# Altium schematic sheet HBridge_and_Power.SchDoc
size A
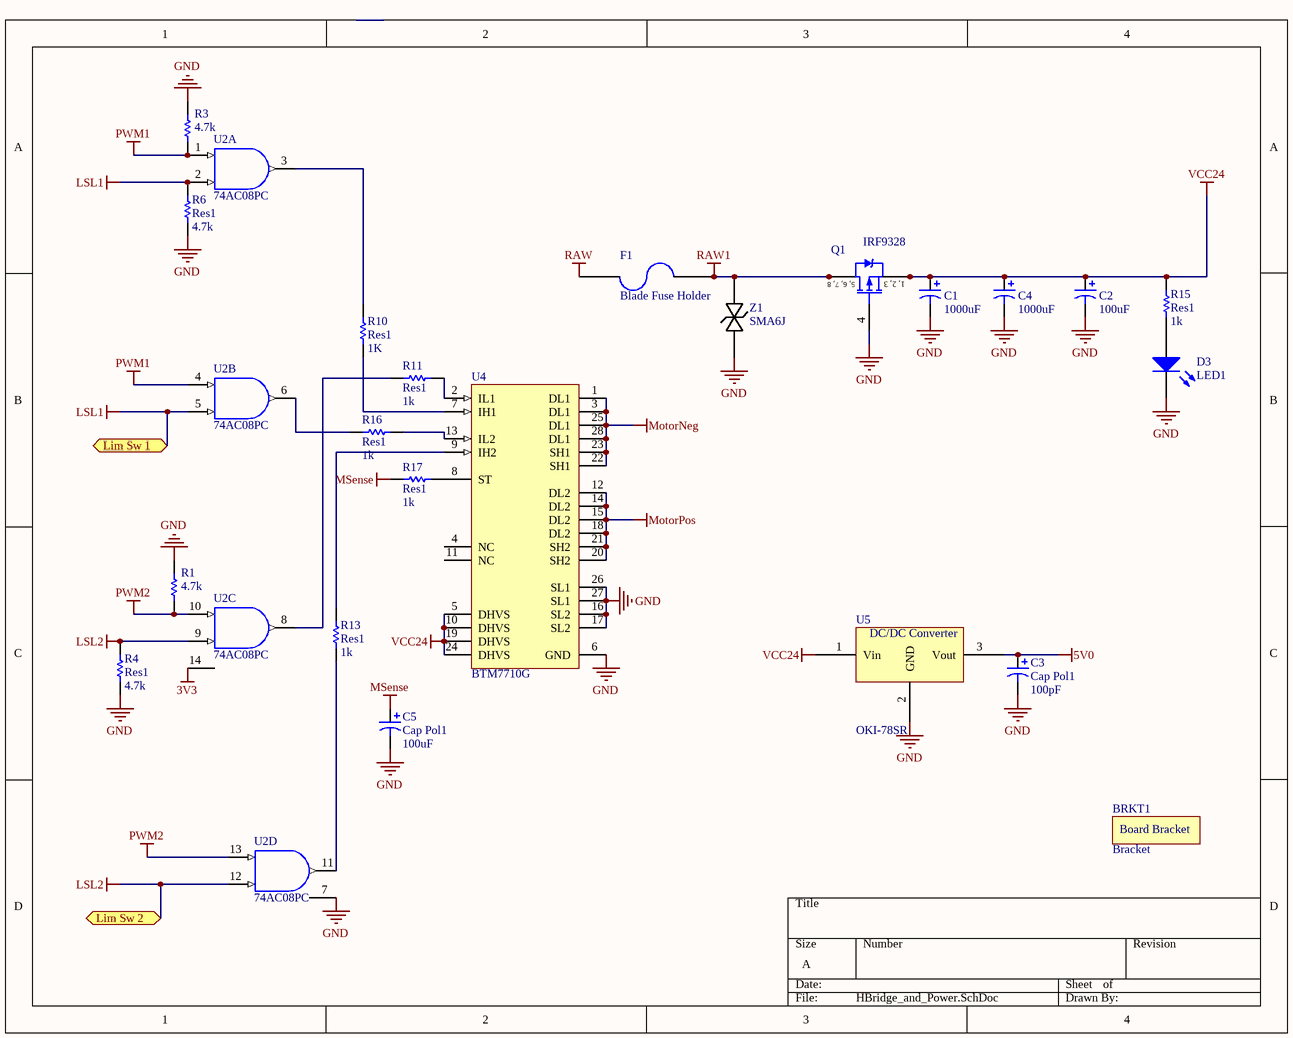
[diagram p0: HBridge_and_Power.SchDoc]

## Parts
BRKT1  Bracket  [Board Bracket]
C1  value 1000uF  [Elec. Cap 5 x 10mm]  (hidden comment: Cap Pol1)
C2  value 100uF  [Elec. Cap 5 x 10mm]  (hidden comment: Cap Pol1)
C3  Cap Pol1  value 100pF  [Elec. Cap 5 x 10mm]
C4  value 1000uF  [Elec. Cap 5 x 10mm]  (hidden comment: Cap Pol1)
C5  Cap Pol1  value 100uF  [Elec. Cap 5 x 10mm]
D3  LED1  [5mm Rad LED]
F1  Blade Fuse Holder  [Fuse Holder]
Q1  IRF9328  [SOIC-8]
R1  value 4.7k  [AXIAL-0.3]  (hidden comment: Res1)
R3  value 4.7k  [AXIAL-0.3]  (hidden comment: Res1)
R4  Res1  value 4.7k  [AXIAL-0.3]
R6  Res1  value 4.7k  [AXIAL-0.3]
R10  Res1  value 1K  [AXIAL-0.3]
R11  Res1  value 1k  [AXIAL-0.3]
R13  Res1  value 1k  [AXIAL-0.3]
R15  Res1  value 1k  [AXIAL-0.3]
R16  Res1  value 1k  [AXIAL-0.3]
R17  Res1  value 1k  [AXIAL-0.3]
U2  74AC08PC  [N14A]  (parts A,B,C,D of 4)
U4  BTM7710G  [INF-PG-DSO-28-22_N]
U5  OKI-78SR  [OKI-78SR]
Z1  SMA6J  [AXIAL-0.9]

## Ports
Lim Sw 1, Lim Sw 2

## Nets
3V3: U2.14(VCC)
5V0: C3.1 U5.3(Vout)
GND: C1.2 C2.2 C3.2 C4.2 C5.2 D3.2(K) Q1.4(G) R1.2 R3.2 R4.1 R6.1 U2.7(GND) U4.6(GND) U4.16(SL2) U4.17(SL2) U4.26(SL1) U4.27(SL1) U5.2(GND) Z1.1(A)
LSL1: R6.2 U2.2(B) U2.5(B) ; port Lim Sw 1
LSL2: R4.2 U2.9(B) U2.12(B) ; port Lim Sw 2
MotorNeg: U4.1(DL1) U4.3(DL1) U4.22(SH1) U4.23(SH1) U4.25(DL1) U4.28(DL1)
MotorPos: U4.12(DL2) U4.14(DL2) U4.15(DL2) U4.18(DL2) U4.20(SH2) U4.21(SH2)
MSense: C5.1 R17.2
PWM1: R3.1 U2.1(A) U2.4(A)
PWM2: R1.1 U2.10(A) U2.13(A)
RAW: F1.1
RAW1: F1.2 Q1.5(D) Q1.6(D) Q1.7(D) Q1.8(D) Z1.2(K)
VCC: U2.14(VCC)
VCC24: C1.1 C2.1 C4.1 Q1.1(S) Q1.2(S) Q1.3(S) R15.2 U4.5(DHVS) U4.10(DHVS) U4.19(DHVS) U4.24(DHVS) U5.1(Vin)
NetD3_1: D3.1(A) R15.1
NetR10_1: R10.1 U4.7(IH1)
NetR10_2: R10.2 U2.3(O)
NetR11_1: R11.1 U4.2(IL1)
NetR11_2: R11.2 U2.8(O)
NetR13_1: R13.1 U2.11(O)
NetR13_2: R13.2 U4.9(IH2)
NetR16_1: R16.1 U4.13(IL2)
NetR16_2: R16.2 U2.6(O)
NetR17_1: R17.1 U4.8(ST)

Not connected (* = marked no-connect by the designer): U4 4(NC) 11(NC)

## Notes on the sheet
- (in symbol 7805) DC/DC Converter
- (in symbol IRF9328 P-FET) 5, 6, 7, 8; 1, 2, 3

## Library data of the parts
BRKT1 = Bracket: Board Bracket; Supplier 1: Digi-Key
C1-C5 = Cap Pol1: Polarized Capacitor (Radial); Published: 8-Jun-2000; LatestRevisionDate: 17-Jul-2002; LatestRevisionNote: Re-released for DXP Platform.; PackageReference: RB7.6-15; Publisher: Altium Limited; PackageDescription: Polarized Capacitor (Radial); 2 Leads
D3 = LED1: Typical RED GaAs LED; Published: 8-Jun-2000; LatestRevisionDate: 08-Jul-2005; LatestRevisionNote: Mech Layer 1 removed.; PackageReference: LED-1; Publisher: Altium Limited; PackageDescription: LED; 2 Leads
F1 = Fuse - Auto: PC Auto-Fuse Holder; Manufacturer: Keystone Electronics; Part Number: 3557-15; Supplier Part Number 1: 36-3557-15-ND; Supplier 1: Digi-Key
Q1 = IRF9328 P-FET: MOSFET P-CH 30V 12A 8-SOIC; Supplier 1: Digi-Key
R1 R3 R4 R6 R10 R11 R13 R15-R17 = Res1: Resistor; Published: 8-Jun-2000; LatestRevisionDate: 17-Jul-2002; LatestRevisionNote: Re-released for DXP Platform.; PackageReference: AXIAL-0.3; Publisher: Altium Limited; PackageDescription: Axial Device, Thru-Hole; 2 Leads; 0.3 in Pin Spacing
U2 = 74AC08PC: Quad 2-Input AND Gate, 14-Pin PDIP, Commercial Grade; IC_Technology: AC; Published: 17-Jul-2002; LatestRevisionDate: 29-May-2009; LatestRevisionNote: Component Body Added.; DatasheetVersion: Nov-1999; PackageVersion: 2000; PackageReference: N14A; Publisher: Altium Limited; PackageDescription: DIP, 14-Pin, Row Spacing 7.62 mm, Pitch 2.54 mm; ComponentLink1Description: Manufacturer Link; ComponentLink1URL: http://www.fairchildsemi.com/; ComponentLink2Description: Datasheet; ComponentLink2URL: http://www.fairchildsemi.com/ds/74%2F74AC08.pdf
U4 = BTM7710G: TrilithIC, 4.5 to 42 V, -40 to 150 degC, PG-DSO-28-22, Reel, Green; Manufacturer: Infineon; Green: TRUE; ID(lim): 15 A; ID(lim) (min): 9 A; Inhibit: FALSE; Iq (typ): 5 uA; Protect: OT, SC; RDS(on) (typ): 110 mOhm; VS (max): 42 V; DatasheetVersion: Rev. 1.0; PackageVersion: Jun-07; PackageReference: PG-DSO-28-22; PackageDescription: 28-Pin Plastic (Green) Dual Small Outline Package, 17.9 x 7.5 mm Body, 1.27 mm Pitch; Supplier 1: Mouser; Supplier Part Number 1: 726-BTM7710G; Supplier 2: Newark; Supplier Part Number 2: 47W3369; Supplier 3: Farnell; Supplier Part Number 3: 2215537; Supplier 4: Digi-Key; Supplier Part Number 4: BTM7710GTR-ND; Supplier 5: Digi-Key; Supplier Part Number 5: BTM7710GCT-ND; Supplier 6: Digi-Key; Supplier Part Number 6: BTM7710GDKR-ND; Group: TrilithIC; Halogen-free: TRUE; Operating Range: 4.5 to 42 V; Mounting Technology: Surface Mount; PartNumber: BTM7710G; ComponentLink1Description: Manufacturer URL; ComponentLink1URL: http://www.infineon.com/; ComponentLink2Description: Datasheet; ComponentLink2URL: http://www.infineon.com/dgdl/BTM7710G%5B1%5D.pdf?folderId=db3a3043156fd5730116144c5d101c30&fileId=db3a30431add1d95011aedf960bb0349&location=en.Products.Automotive_ICs.Motor_Drivers__Automotive_.Integrated_High_Current_Motor_Drivers__NovalithIC____Trilith_IC_.DATASHEET.BTM7710G[1].pdf; ComponentLink3Description: Package Specification; ComponentLink3URL: http://www.infineon.com/dgdl/BTM7700G_DS_10.pdf?folderId=db3a304412b407950112b408e8c90004&fileId=db3a304316f66ee80117642f65ef6a96&sId=db3a30443d67b5ca013d81ef92182d8b
U5 = 7805: 5V DC/DC Converter (7805 replacement); Supplier 1: Digi-Key; Supplier 2: Digi-Key; Supplier Part Number 1: 811-2196-5-ND; Supplier Part Number 2: 811-2692-ND
Z1 = Zener - Bidirectional: TVS DIODE 15VWM 24.4VC SMA; Manufacturer: Micro Commercial Co; PartNumber: SMA6J15CA-TP; Supplier 1: Digi-Key; Supplier Part Number 1: SMA6J15CA-TPMSCT-ND